# EAGLE schematic CUTDOWN ASSEMBLY (EAGLE 9.3.0)
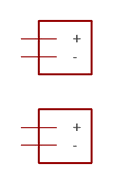
[diagram p0: schematic, sheet 1]

## Parts
U$1  CUTDOWN_ASSEMBLY  [CUTDOWN_ASSEMBLY]
U$2  CUTDOWN_ASSEMBLY  [CUTDOWN_ASSEMBLY]
Unconnected: U$1.+ U$1.- U$2.+ U$2.-

## Library data of the parts
U$1 U$2 = Adafruit_Arduino:CUTDOWN_ASSEMBLY